# Altium schematic sheet Sheet2.SchDoc
size A
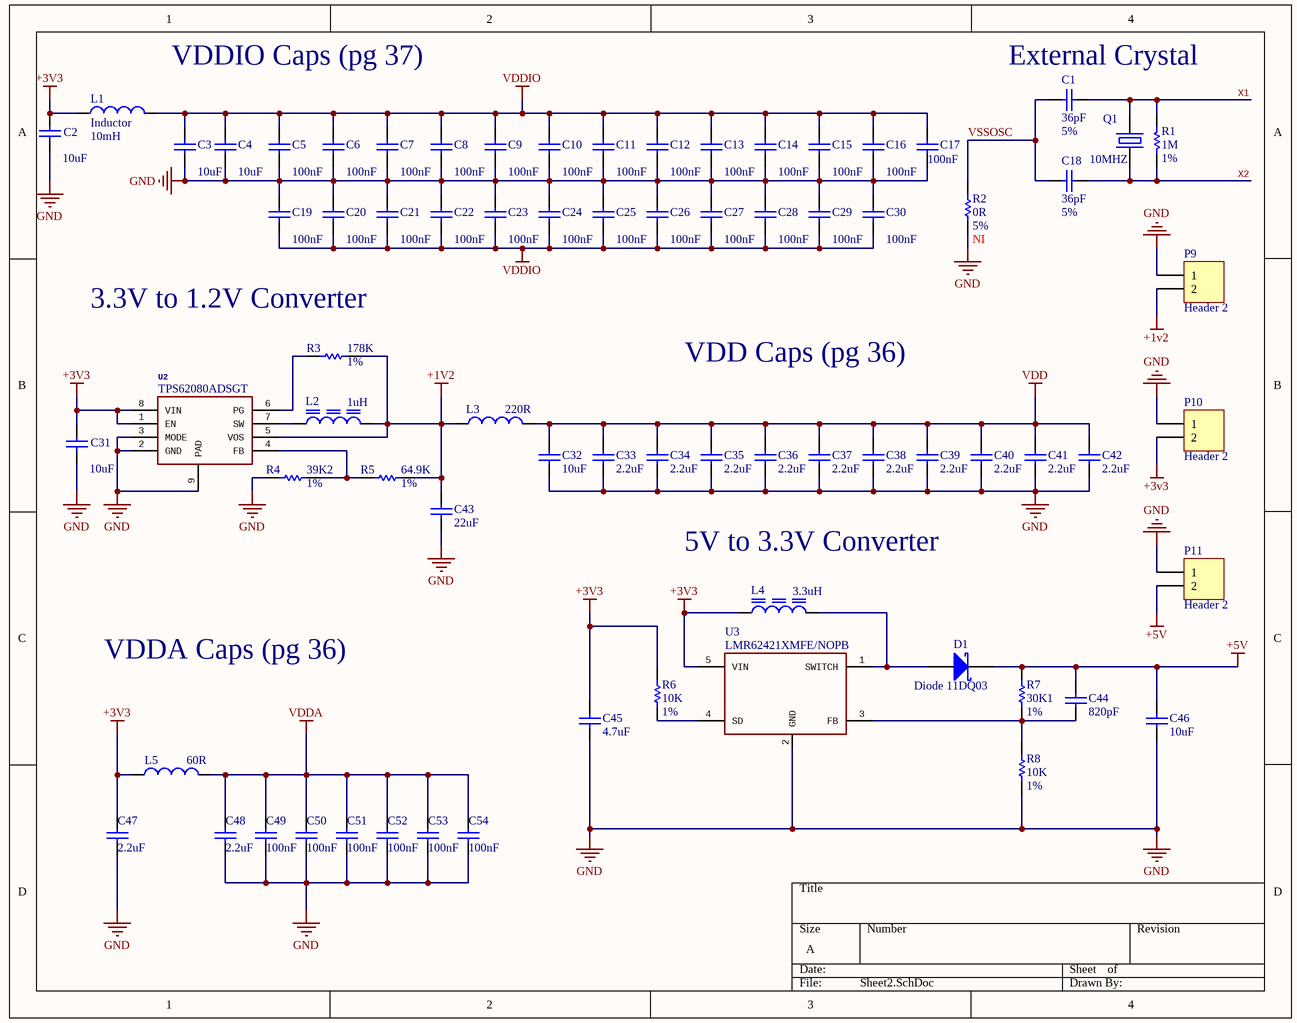
[diagram p0: Sheet2.SchDoc]

## Parts
C1  Rating: 5%  [C0805]  (hidden comment: 36pF)
C2  value 10uF  [C0805]  (hidden comment: Cap Semi)
C3  value 10uF  [C0805]  (hidden comment: Cap Semi)
C4  value 10uF  [C0805]  (hidden comment: Cap Semi)
C5  value 100nF  [C0805]  (hidden comment: Cap Semi)
C6  value 100nF  [C0805]
C7  value 100nF  [C0805]  (hidden comment: Cap Semi)
C8  value 100nF  [C0805]  (hidden comment: Cap Semi)
C9  value 100nF  [C0805]  (hidden comment: Cap Semi)
C10  value 100nF  [C0805]
C11  value 100nF  [C0805]  (hidden comment: Cap Semi)
C12  value 100nF  [C0805]  (hidden comment: Cap Semi)
C13  value 100nF  [C0805]  (hidden comment: Cap Semi)
C14  value 100nF  [C0805]  (hidden comment: Cap Semi)
C15  value 100nF  [C0805]  (hidden comment: Cap Semi)
C16  value 100nF  [C0805]  (hidden comment: Cap Semi)
C17  value 100nF  [C0805]  (hidden comment: Cap Semi)
C18  Rating: 5%  [C0805]  (hidden comment: 36pF)
C19  value 100nF  [C0805]  (hidden comment: Cap Semi)
C20  value 100nF  [C0805]
C21  value 100nF  [C0805]  (hidden comment: Cap Semi)
C22  value 100nF  [C0805]  (hidden comment: Cap Semi)
C23  value 100nF  [C0805]  (hidden comment: Cap Semi)
C24  value 100nF  [C0805]
C25  value 100nF  [C0805]  (hidden comment: Cap Semi)
C26  value 100nF  [C0805]  (hidden comment: Cap Semi)
C27  value 100nF  [C0805]  (hidden comment: Cap Semi)
C28  value 100nF  [C0805]  (hidden comment: Cap Semi)
C29  value 100nF  [C0805]  (hidden comment: Cap Semi)
C30  value 100nF  [C0805]  (hidden comment: Cap Semi)
C31  value 10uF  [C0805]  (hidden comment: Cap Semi)
C32  10uF  [C0805]
C33  2.2uF  [C0805]
C34  2.2uF  [C0805]
C35  2.2uF  [C0805]
C36  2.2uF  [C0805]
C37  2.2uF  [C0805]
C38  2.2uF  [C0805]
C39  2.2uF  [C0805]
C40  2.2uF  [C0805]
C41  2.2uF  [C0805]
C42  2.2uF  [C0805]
C43  22uF  [C0805]
C44  820pF  [C0805]
C45  4.7uF  [C0805]
C46  10uF  [C0805]
C47  2.2uF  [C0805]
C48  2.2uF  [C0805]
C49  100nF  [C0805]
C50  100nF  [C0805]
C51  100nF  [C0805]
C52  100nF  [C0805]
C53  100nF  [C0805]
C54  100nF  [C0805]
D1  Diode 11DQ03  [DO-204AL]
L1  Inductor  value 10mH  [6-0805_L]
L2  1uH  [6-0805_L]
L3  220R  [6-0805_L]
L4  3.3uH  [6-0805_L]
L5  60R  [6-0805_L]
P9  Header 2  [HDR1X2]
P10  Header 2  [HDR1X2]
P11  Header 2  [HDR1X2]
Q1  value 10MHZ  [HC-49U]  (hidden comment: ATS100B-E)
R1  Rating: 1%  [6-0805_L]  (hidden comment: 1M)
R2  Rating: 5%  ASSY: NI  [6-0805_L]  (hidden comment: 0R)
R3  Rating: 1%  [6-0805_L]  (hidden comment: 178K)
R4  Rating: 1%  [6-0805_L]  (hidden comment: 39K2)
R5  Rating: 1%  [6-0805_L]  (hidden comment: 64.9K)
R6  Rating: 1%  [6-0805_L]  (hidden comment: 10K)
R7  Rating: 1%  [6-0805_L]  (hidden comment: 30K1)
R8  Rating: 1%  [6-0805_L]  (hidden comment: 10K)
U2  TPS62080ADSGT  [SON50P200X200X80-9N]
U3  LMR62421XMFE/NOPB  [DBV5-L]

## Nets
+1V2: C43.2 L2.2 L3.1 P9.2 R3.2 R5.2 U2.5(VOS)
+3V3: C2.2 C31.2 C45.2 C47.2 L1.1 L4.1 L5.1 P10.2 R6.1 U2.1(EN) U2.8(VIN) U3.5(VIN)
+5V: C44.2 C46.1 D1.2(K) P11.2 R7.1
GND: C2.1 C3.1 C4.1 C5.1 C6.1 C7.1 C8.1 C9.1 C10.1 C11.1 C12.1 C13.1 C14.1 C15.1 C16.1 C17.1 C19.2 C20.2 C21.2 C22.2 C23.2 C24.2 C25.2 C26.2 C27.2 C28.2 C29.2 C30.2 C31.1 C32.1 C33.1 C34.1 C35.1 C36.1 C37.1 C38.1 C39.1 C40.1 C41.1 C42.1 C43.1 C45.1 C46.2 C47.1 C48.1 C49.1 C50.1 C51.1 C52.1 C53.1 C54.1 P9.1 P10.1 P11.1 R2.2 R4.1 R8.2 U2.2(GND) U2.3(MODE) U2.9(PAD) U3.2(GND)
VDD: C32.2 C33.2 C34.2 C35.2 C36.2 C37.2 C38.2 C39.2 C40.2 C41.2 C42.2 L3.2
VDDA: C48.2 C49.2 C50.2 C51.2 C52.2 C53.2 C54.2 L5.2
VDDIO: C3.2 C4.2 C5.2 C6.2 C7.2 C8.2 C9.2 C10.2 C11.2 C12.2 C13.2 C14.2 C15.2 C16.2 C17.2 C19.1 C20.1 C21.1 C22.1 C23.1 C24.1 C25.1 C26.1 C27.1 C28.1 C29.1 C30.1 L1.2
VSSOSC: C1.2 C18.2 R2.1
X1: C1.1 Q1.2 R1.2
X2: C18.1 Q1.1 R1.1
NetC44_1: C44.1 R7.2 R8.1 U3.3(FB)
NetD1_1: D1.1(A) L4.2 U3.1(SWITCH)
NetL2_1: L2.1 U2.7(SW)
NetR3_1: R3.1 U2.6(PG)
NetR4_2: R4.2 R5.1 U2.4(FB)
NetR6_2: R6.2 U3.4(SD)

## Notes on the sheet
- VDDIO Caps (pg 37)
- (near C1) External Crystal
- 3.3V to 1.2V Converter
- VDD Caps (pg 36)
- 5V to 3.3V Converter
- VDDA Caps (pg 36)

## Library data of the parts
C1 C18 = 1004001100255: CAP,36pF,+/-5%,C0G,50V,SMD0402; Manufacturer: MURATA; Manufacturer Part Number: GRM1555C1H360JA01D; Embest PN: 1004001100255; Value: 36pF; Part Type: Ceramic Capacitor
C2-C4 C31 = Cap Semi: 10uF; Published: 8-Jun-2000; LatestRevisionDate: 29-May-2009; LatestRevisionNote: IPC-7351 Footprint Added.; PackageReference: C1206; Publisher: Altium Limited; PackageDescription: Chip Capacitor
C5-C17 C19-C30 = Cap Semi: 100nF; Published: 8-Jun-2000; LatestRevisionDate: 29-May-2009; LatestRevisionNote: IPC-7351 Footprint Added.; PackageReference: C1206; Publisher: Altium Limited; PackageDescription: Chip Capacitor
C32 = 1004001100128: CAP,10UF,+/-20%,X5R,6.3V,SMD0603; Manufacturer: MURATA; Manufacturer Part Number: GRM188R60J106ME47D; Rating: 20%; Embest PN: 1004001100128; Value: 10uF; Part Type: Ceramic Capacitor
C33-C42 C47 C48 = 1004001100059: CAP,2.2UF,+/-20%,X5R,6.3V,SMD0402; Manufacturer: MURATA; Manufacturer Part Number: GRM155R60J225ME15D; Rating: 20%; Embest PN: 1004001100059; Value: 2.2uF; Part Type: Ceramic Capacitor
C43 = 1004001100130: CAP,22UF,+/-20%,X5R,6.3V,SMD0603; Manufacturer: MURATA; Manufacturer Part Number: GRM188R60J226MEA0D; Rating: 20%; Embest PN: 1004001100130; Value: 22uF; Part Type: Ceramic Capacitor
C44 = 1004001100029: CAP,820PF,+/-5%,C0G,50V,SMD0402; Manufacturer: MURATA; Manufacturer Part Number: GRM1555C1H821JA01D; Rating: 5%; Embest PN: 1004001100029; Value: 820pF; Part Type: Ceramic Capacitor
C45 = 1004001100218: CAP,4.7UF,+/-20%,X5R,6.3V,SMD0402 fix PN add D（20151023）; Manufacturer: MURATA; Manufacturer Part Number: GRM155R60J475ME47D; Rating: 20%; Embest PN: 1004001100218; Value: 4.7uF; Part Type: Ceramic Capacitor
C46 = 1004001100183: CAP,10UF,+/-10%,X7R,25V,SMD1210; Manufacturer: MURATA; Manufacturer Part Number: GRM32DR71E106KA12L; Rating: 10%; Embest PN: 1004001100183; Value: 10uF; Part Type: Ceramic Capacitor
C49-C54 = 1004001100187: CAP,100NF(0.1uf),+/-10%,X5R,10V,SMD0402; Manufacturer: MURATA; Manufacturer Part Number: GRM155R61A104KA01D; Rating: 10%; Embest PN: 1004001100187; Value: 100nF; Part Type: Ceramic Capacitor
D1 = Diode 11DQ03: Schottky Rectifier; Published: 8-Jun-2000; LatestRevisionDate: 17-Jul-2002; LatestRevisionNote: Re-released for DXP Platform.; DatasheetVersion: Dec-1997; PackageReference: DO-204AL; Publisher: Altium Limited; PackageDescription: Diode, Axial; Body 5.2 x 2.7 mm (LxDia. max), Lead Dia. 0.86 mm (max); Code_JEDEC: DO-204-AL; ComponentLink1Description: Manufacturer Link; ComponentLink1URL: http://www.irf.com/; ComponentLink2Description: Datasheet; ComponentLink2URL: http://www.irf.com/product-info/datasheets/data/11dq03.pdf
L1 = Inductor: Code_IEC: 1005; Published: 8-Jun-2000; LatestRevisionDate: 29-May-2009; LatestRevisionNote: IPC-7351 Footprint Added.; PackageReference: 0402-A; Publisher: Altium Limited; PackageDescription: Chip Inductor; Code_JEITA: 0402
L2 = 1005001100053: FIXED IND 1UH 1.62A 40 MOHM SMD,+/-30%; Manufacturer: MURATA; Manufacturer Part Number: LQH3NPN1R0NJ0L; Embest PN: 1005001100053; Value: 1uH; Part Type: Inductor; Rating: 1.62A
L3 = 1005005100064: FERRITE BEAD 220 OHM 0402,+/-25%; Manufacturer: Taiyo Yuden; Manufacturer Part Number: BKP1005EM221-T; Embest PN: 1005005100064; Value: 220R; Part Type: Ferrite Bead
L4 = 1005004100014: Power Inductor,Magnetic shielded,3.3uH,1.4A,0.085ohm,3.8X3.8X1.6mm,SMD; Manufacturer: SUMIDA; Manufacturer Part Number: CDRH3D16/HPNP-3R3NC; Embest PN: 1005004100014; Value: 3.3uH; Part Type: Inductor; Rating: 1.4A
L5 = 1005005100005: Ferrite Bead,60ohm@100MHz,+/-25%,1700mA,0.06ohm,SMD0402; Manufacturer: MURATA; Manufacturer Part Number: BLM15PD600SN1D; Embest PN: 1005005100005; Value: 60R; Part Type: Ferrite Bead; Rating: 1700mA
P9-P11 = Header 2: Header, 2-Pin; LatestRevisionDate: 17-Jul-2002; LatestRevisionNote: Re-released for DXP Platform.; Publisher: Altium Limited
Q1 = 1008002200125: Crystal 10.0000MHz 30ppm 18pF 60 Ohm -40°C - 85°C Through Hole HC49/US; Manufacturer: CTS; Embest PN: 1008002200125; Part Type: Crystal; Manufacturer Part Number: ATS100B-E
R1 = 1003001100155: RES,1M,+/-1%,1/16W,SMD0402; Manufacturer: YAGEO; Manufacturer Part Number: RC0402FR-071ML; Embest PN: 1003001100155; Value: 1M; Part Type: Thick film Resistor
R2 = 1003001100001: RES,0R,+/-5%,1/16W,SMD0402; Manufacturer: YAGEO; Manufacturer Part Number: RC0402JR-070RL; Embest PN: 1003001100001; Value: 0R; Part Type: Thick film Resistor
R3 = 1003001100723: RES, 178K OHM, 1%, 1/10W, SMD0402; Manufacturer: PANASONIC; Manufacturer Part Number: ERJ-2RKF1783X; Embest PN: 1003001100723; Value: 178K; Part Type: Thick film Resistor
R4 = 1003001100098: RES,39K2,+/-1%,1/16W,SMD0402; Manufacturer: YAGEO; Manufacturer Part Number: RC0402FR-0739K2L; Embest PN: 1003001100098; Value: 39K2; Part Type: Thick film Resistor
R5 = 1003001100730: RES, 64.9K OHM, 1%, 1/10W, SMD0402; Manufacturer: PANASONIC; Manufacturer Part Number: ERJ-2RKF6492X; Embest PN: 1003001100730; Value: 64.9K; Part Type: Thick film Resistor
R6 R8 = 1003001100071: RES,10K,+/-1%,1/16W,SMD0402; Manufacturer: YAGEO; Manufacturer Part Number: RC0402FR-0710KL; Embest PN: 1003001100071; Value: 10K; Part Type: Thick film Resistor
R7 = 1003001100091: RES,30K1,+/-1%,1/16W,SMD0402; Manufacturer: YAGEO; Manufacturer Part Number: RC0402FR-0730K1L; Embest PN: 1003001100091; Value: 30K1; Part Type: Thick film Resistor
U2 = 1002005100089C: IC REG BUCK SYNC ADJ 1.2A 8WSON; Manufacturer: TI; Embest PN: 1002005100089C; Value: TPS62080ADSGT; Part Type: DC-DC; Manufacturer Part Number: TPS62080ADSGT
U3 = 1002005100073C: Conv DC-DC Single Step Up 2.7V to 5.5V 5-Pin SOT-23 T/R ,CUSTOMER SUPPLY; Manufacturer: TI; Embest PN: 1002005100073C; Value: LMR62421XMFE/NOPB; Part Type: DC-DC; Manufacturer Part Number: LMR62421XMFE/NOPB